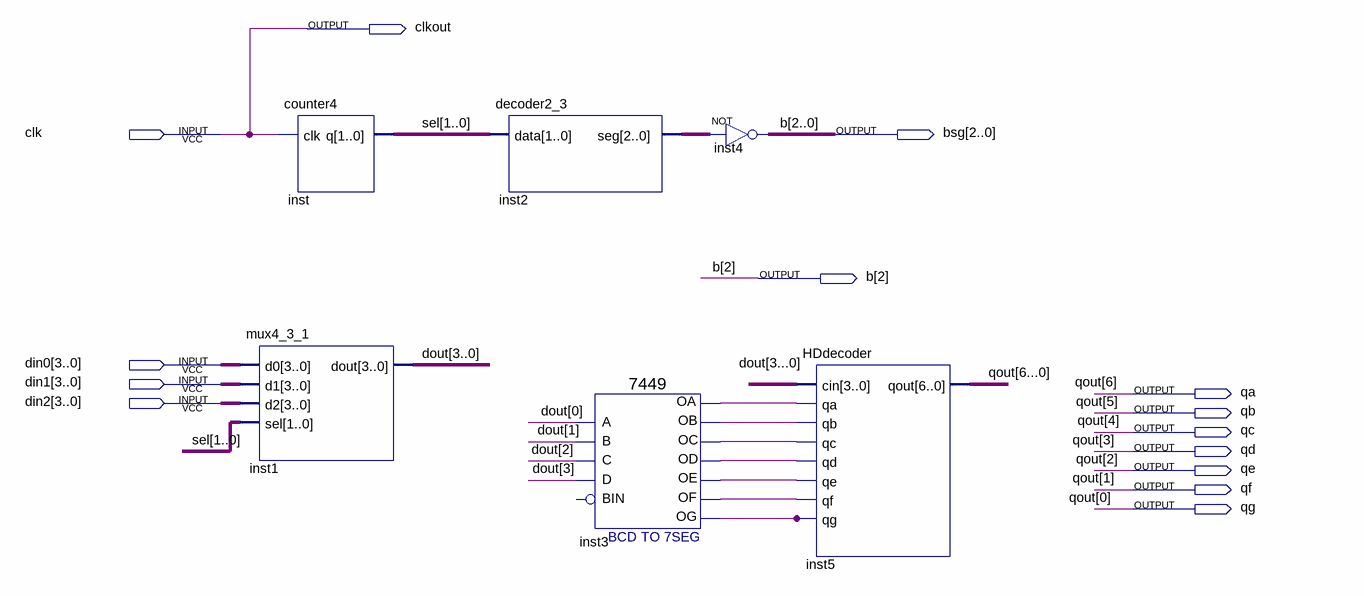
[diagram p0: schematic sheet]
// Quartus schematic scan_led3.bdf as structural Verilog: 6 symbols, 14 pins
module scan_led3 (
  input  clk,
  input  [3:0] din0,
  input  [3:0] din1,
  input  [3:0] din2,
  output clkout,
  output [2:0] bsg,
  output [2:2] b,
  output qa,
  output qb,
  output qc,
  output qd,
  output qe,
  output qf,
  output qg
);

  wire \dout[3...0] , inst3_oa, inst3_ob, inst3_oc, inst3_od, inst3_oe, inst3_of, inst3_og, \qout[6...0] ;
  wire [1:0] sel;
  wire [2:0] inst2_seg;
  wire [3:0] dout;

  counter4 inst (.clk(clk), .q(sel));
  mux4_3_1 inst1 (.d0(din0), .d1(din1), .d2(din2), .sel(sel), .dout(dout));
  decoder2_3 inst2 (.data(sel), .seg(inst2_seg));
  \7449  inst3 (
    .A(dout[0]), .C(dout[2]), .B(dout[1]), .D(dout[3]), .OC(inst3_oc), .OD(inst3_od), .OF(inst3_of),
    .OG(inst3_og), .OB(inst3_ob), .OA(inst3_oa), .OE(inst3_oe));  // open: BIN
  assign {b[2], bsg[1:0]} = ~inst2_seg;  // NOT inst4, 3 bits wide
  HDdecoder inst5 (
    .cin({4{\dout[3...0] }}), .qa(inst3_oa), .qb(inst3_ob), .qc(inst3_oc), .qd(inst3_od), .qe(inst3_oe),
    .qf(inst3_of), .qg(inst3_og), .qout(\qout[6...0] ));

  assign bsg[2] = b[2];
  assign clkout = clk;

  // Other names for the same wires on the sheet: b[1:0] = bsg[1:0]; qout[6:0] = {qa, qb, qc, qd, qe, qf, qg}
endmodule
